# EAGLE design dw-shield-V1.1 (EAGLE 9.5.1)
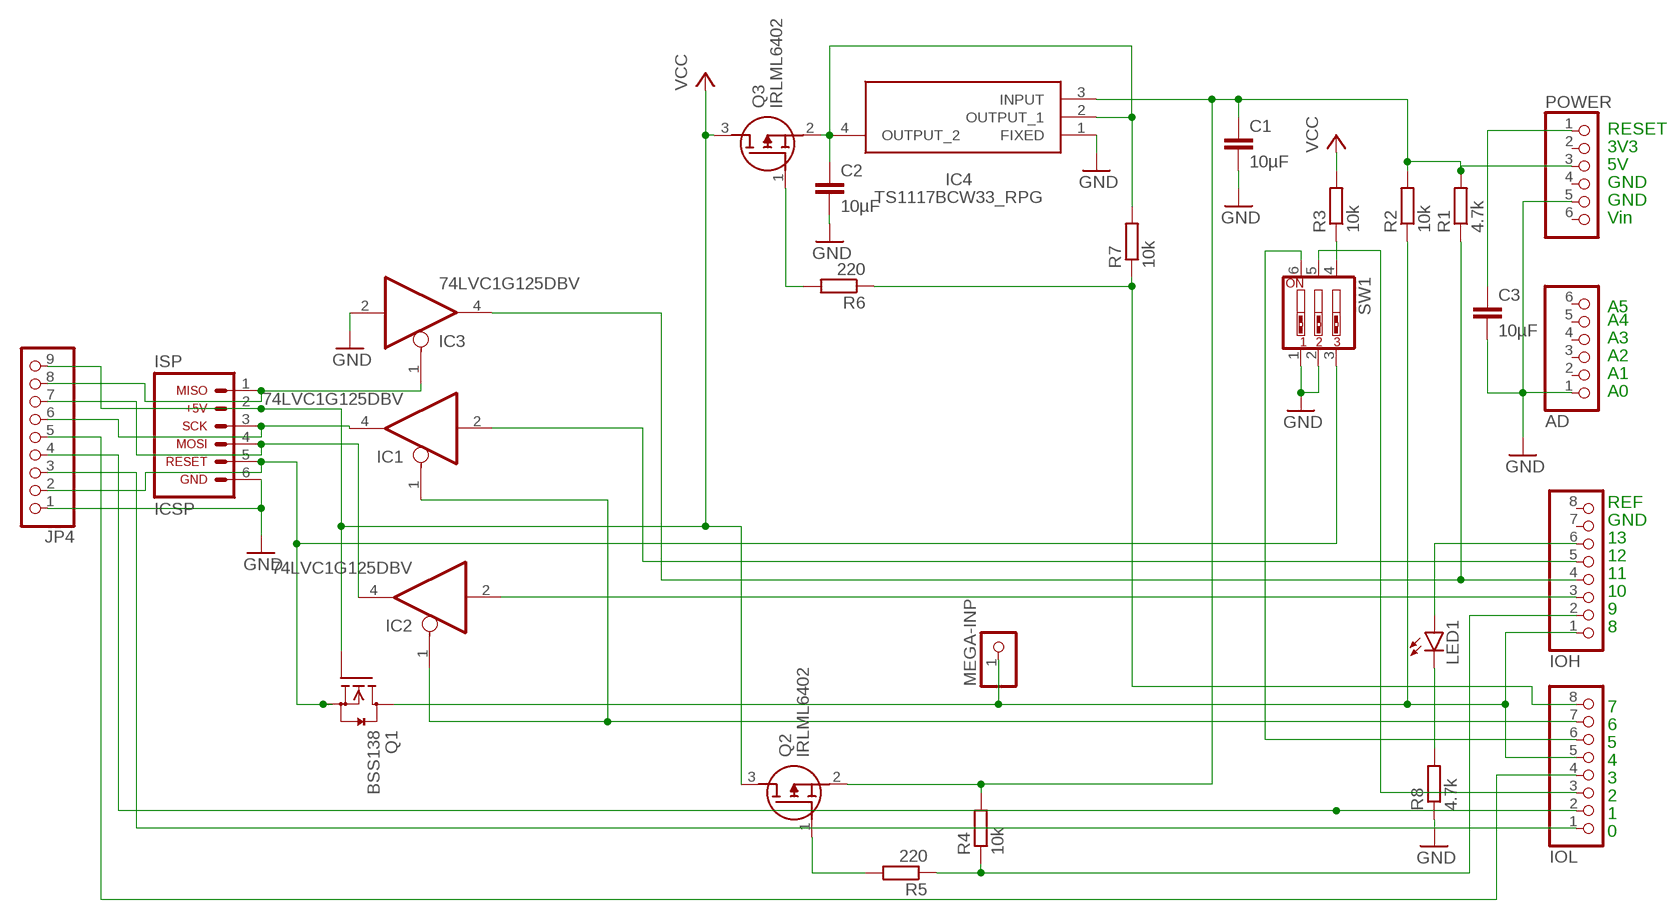
[diagram p0: schematic, sheet 1]

## Parts
AD  PINHD-1X6  [1X06]
C1  10µF  C-EUC1206  [C1206]
C2  10µF  C-EUC1206  [C1206]
C3  10µF  C-EUC1206  [C1206]
IC1  74LVC1G125DBV  [SOT23-5]
IC2  74LVC1G125DBV  [SOT23-5]
IC3  74LVC1G125DBV  [SOT23-5]
IC4  TS1117BCW33_RPG  [SOT230P700X190-4N]
IOH  PINHD-1X8  [1X08]
IOL  PINHD-1X8  [1X08]
ISP  ARDUINO_CONN-ICSP  [CONN-2X03]
JP4  PINHD-1X9  [1X09]
LED1  LEDCHIPLED_1206  [CHIPLED_1206]
MEGA-INP  PINHD-1X1  [1X01]
POWER  PINHD-1X6  [1X06]
Q1  BSS138  [SOT23]
Q2  IRLML6402  [SOT95P237X112-3N]
Q3  IRLML6402  [SOT95P237X112-3N]
R1  4.7k  R-EU_R1206  [R1206]
R2  10k  R-EU_R1206  [R1206]
R3  10k  R-EU_R1206  [R1206]
R4  10k  R-EU_R1206  [R1206]
R5  220  R-EU_R1206  [R1206]
R6  220  R-EU_R1206  [R1206]
R7  10k  R-EU_R1206  [R1206]
R8  4.7k  R-EU_R1206  [R1206]
SW1  SW_DIP-3  [EDG-03]

## Nets
GND: AD.1 C1.2 C2.2 C3.2 IC3.2(I) IC4.1(FIXED) ISP.6 JP4.1 POWER.5 R8.1 SW1.1 SW1.2
N$1: C1.1 IC4.3(INPUT) POWER.3 Q2.2(S) R1.2 R2.2 R4.2
N$2: IOH.1 IOL.5 MEGA-INP.1 Q1.3(D) R2.1
N$3: IC1.4(O) ISP.3 JP4.6
N$4: IC3.1(OE) ISP.1 JP4.8
N$5: IC2.4(O) ISP.4 JP4.7
N$6: IC1.1(OE) IC2.1(OE) IOL.7
N$7: IC2.2(I) IOH.3
N$8: IC1.2(I) IOH.5
N$9: IC3.4(O) IOH.4 R1.1
N$10: Q2.1(G) R5.2
N$11: ISP.5 JP4.2 Q1.2(S) SW1.3
N$12: R3.1 SW1.4
N$13: IOL.6 SW1.6
N$14: IOL.3 SW1.5
N$15: C2.1 IC4.2(OUTPUT_1) IC4.4(OUTPUT_2) Q3.2(S) R7.2
N$16: IOH.2 R4.1 R5.1
N$17: Q3.1(G) R6.2
N$18: IOL.8 R6.1 R7.1
N$19: C3.1 POWER.1
N$20: IOL.2 JP4.4
N$21: IOH.6 LED1.A
N$22: LED1.C R8.2
N$23: IOL.1 JP4.3
N$24: IOL.4 JP4.5
VCC: ISP.2 JP4.9 Q1.1(G) Q2.3(D) Q3.3(D) R3.2
Unconnected: AD.2 AD.3 AD.4 AD.5 AD.6 IOH.7 IOH.8 POWER.2 POWER.4 POWER.6

## Notes on the sheet
- RESET
- 3V3
- 5V
- GND
- GND
- Vin
- A5
- A4
- A3
- A2
- A1
- A0
- REF
- GND
- 13
- 12
- 11
- 10
- 9
- 8
- 7
- 6
- 5
- 4
- 3
- 2
- 1
- 0

## Power pins joined to a net without a drawn wire
GND: IC1.3(GND) IC2.3(GND) IC3.3(GND)
VCC: IC1.5(VCC) IC2.5(VCC) IC3.5(VCC)

## Library data of the parts
AD POWER = pinhead:PINHD-1X6: PIN HEADER
C1-C3 = rcl:C-EU: CAPACITOR, European symbol; SPICEPREFIX: C
IC1-IC3 = 74xx-little-us:74*1G125: Single Bus Buffer Gate with 3-State Output
IC4 = TS1117BCW33_RPG:TS1117BCW33_RPG: Taiwan Semiconductor TS1117BCW33 RPG, LDO Regulator, 800mA, 3.3 V, +/-2% 4-Pin, SOT-223 Source: Datasheet <http://uk.rs-online.com/web/p/products/1698939>; ARROW_PART_NUMBER: TS1117BCW33 RPG; ARROW_PRICE-STOCK: https://www.arrow.com/en/products/ts1117bcw33rpg/taiwan-semiconductor; DESCRIPTION: Taiwan Semiconductor TS1117BCW33 RPG, LDO Regulator, 800mA, 3.3 V, +/-2% 4-Pin, SOT-223; HEIGHT: 1.9mm; MANUFACTURER_NAME: Taiwan Semiconductor; MANUFACTURER_PART_NUMBER: TS1117BCW33 RPG; MOUSER_PART_NUMBER: 821-TS1117BCW33RPG; MOUSER_PRICE-STOCK: https://www.mouser.co.uk/ProductDetail/Taiwan-Semiconductor/TS1117BCW33-RPG?qs=5aG0NVq1C4zdwcJSPRwZGg%3D%3D
IOH IOL = pinhead:PINHD-1X8: PIN HEADER
ISP = arduino_jw:ARDUINO_CONN-ICSP: Arduino ICSP I/O Header This is the ICSP I/O header on the Arduino Uno R3. This connector is labeled with the following pin assignments: MISO +5V SCK MOSI RESET GND NOTE: Be sure you install this connector with the correct orientation on your PCB layout. Pin 1 has a square pad to assist with orientation.
JP4 = pinhead:PINHD-1X9: PIN HEADER
LED1 = led:LED: LED OSRAM: - CHIPLED LG R971, LG N971, LY N971, LG Q971, LY Q971, LO R971, LY R971 LH N974, LH R974 LS Q976, LO Q976, LY Q976 LO Q996 - Hyper CHIPLED LW Q18S LB Q993, LB Q99A, LB R99A - SideLED LS A670, LO A670, LY A670, LG A670, LP A670 LB A673, LV A673, LT A673, LW A673 LH A674 LY A675 LS A676, LA A676, LO A676, LY A676, LW A676 LS A679, LY A679, LG A679 - Hyper Micro SIDELED® LS Y876, LA Y876, LO Y876, LY Y876 LT Y87S - SmartLED LW L88C, LW L88S LB L89C, LB L89S, LG L890 LS L89K, LO L89K, LY L89K LS L896, LA L896, LO L896, LY L896 - TOPLED LS T670, LO T670, LY T670, LG T670, LP T670 LSG T670, LSP T670, LSY T670, LOP T670, LYG T670 LG T671, LOG T671, LSG T671 LB T673, LV T673, LT T673, LW T673 LH T674 LS T676, LA T676, LO T676, LY T676, LB T676, LH T676, LSB T676, LW T676 LB T67C, LV T67C, LT T67C, LS T67K, LO T67K, LY T67K, LW E67C LS E67B, LA E67B, LO E67B, LY E67B, LB E67C, LV E67C, LT E67C LW T67C LS T679, LY T679, LG T679 LS T770, LO T770, LY T770, LG T770, LP T770 LB T773, LV T773, LT T773, LW T773 LH T774 LS E675, LA E675, LY E675, LS T675 LS T776, LA T776, LO T776, LY T776, LB T776 LHGB T686 LT T68C, LB T68C - Hyper Mini TOPLED® LB M676 - Mini TOPLED Santana® LG M470 LS M47K, LO M47K, LY M47K Source: http://www.osram.convergy.de LUXEON: - LUMILED® LXK2-PW12-R00, LXK2-PW12-S00, LXK2-PW14-U00, LXK2-PW14-V00 LXK2-PM12-R00, LXK2-PM12-S00, LXK2-PM14-U00 LXK2-PE12-Q00, LXK2-PE12-R00, LXK2-PE12-S00, LXK2-PE14-T00, LXK2-PE14-U00 LXK2-PB12-K00, LXK2-PB12-L00, LXK2-PB12-M00, LXK2-PB14-N00, LXK2-PB14-P00, LXK2-PB14-Q00 LXK2-PR12-L00, LXK2-PR12-M00, LXK2-PR14-Q00, LXK2-PR14-R00 LXK2-PD12-Q00, LXK2-PD12-R00, LXK2-PD12-S00 LXK2-PH12-R00, LXK2-PH12-S00 LXK2-PL12-P00, LXK2-PL12-Q00, LXK2-PL12-R00 Source: www.luxeon.com KINGBRIGHT: KA-3528ASYC Source: www.kingbright.com
MEGA-INP = pinhead:PINHD-1X1: PIN HEADER
Q1 = m-pad-2.1:BSS138: Fairchild Semiconductors BSS138 N-Channel Logic Level Enhancement Mode Field Effect Transistor General Description: These N-Channel enhancement mode field effect transistors are produced using Fairchild's proprietary, high cell density, DMOS technology. These products have been designed to minimize on-state resistance while provide rugged, reliable, and fast switching performance.These products are particularly suited for low voltage, low current applications such as small servo motor control, power MOSFET gate drivers, and other switching applications. Features: 0.22 A, 50 V. RDS(ON) = 3.5Ohm @ VGS = 10 V RDS(ON) = 6.0Ohm @ VGS = 4.5 V High density cell design for extremely low RDS(ON) Rugged and Reliable Compact industry standard SOT-23 surface mount package Please send any comments to: messi@users.sourceforge.net
Q2 Q3 = IRLML6402:IRLML6402: P-Channel MOSFET Transistor, 3.7 A, 20 V, 3-Pin SOT-23 International Rectifier IRLML6402 Source: Datasheet <https://datasheetspdf.com/pdf/513015/InternationalRectifier/IRLML6402/1>; DESCRIPTION: P-Channel MOSFET Transistor, 3.7 A, 20 V, 3-Pin SOT-23 International Rectifier IRLML6402; HEIGHT: 1.12mm; MANUFACTURER_NAME: Infineon; MANUFACTURER_PART_NUMBER: IRLML6402; MOUSER_PART_NUMBER: N/A; MOUSER_PRICE-STOCK: https://www.mouser.co.uk/ProductDetail/Infineon-IR/IRLML6402/?qs=Gkr2N%2F2q3o277qI%252BRzUP%252Bw%3D%3D
R1-R8 = rcl:R-EU_: RESISTOR, European symbol; SPICEPREFIX: R
SW1 = special:SW_DIP-3: DIP SWITCH

## Net classes
0 default: width 0.152 mm, drill 0.305 mm, clearance 0.152 mm

## Board
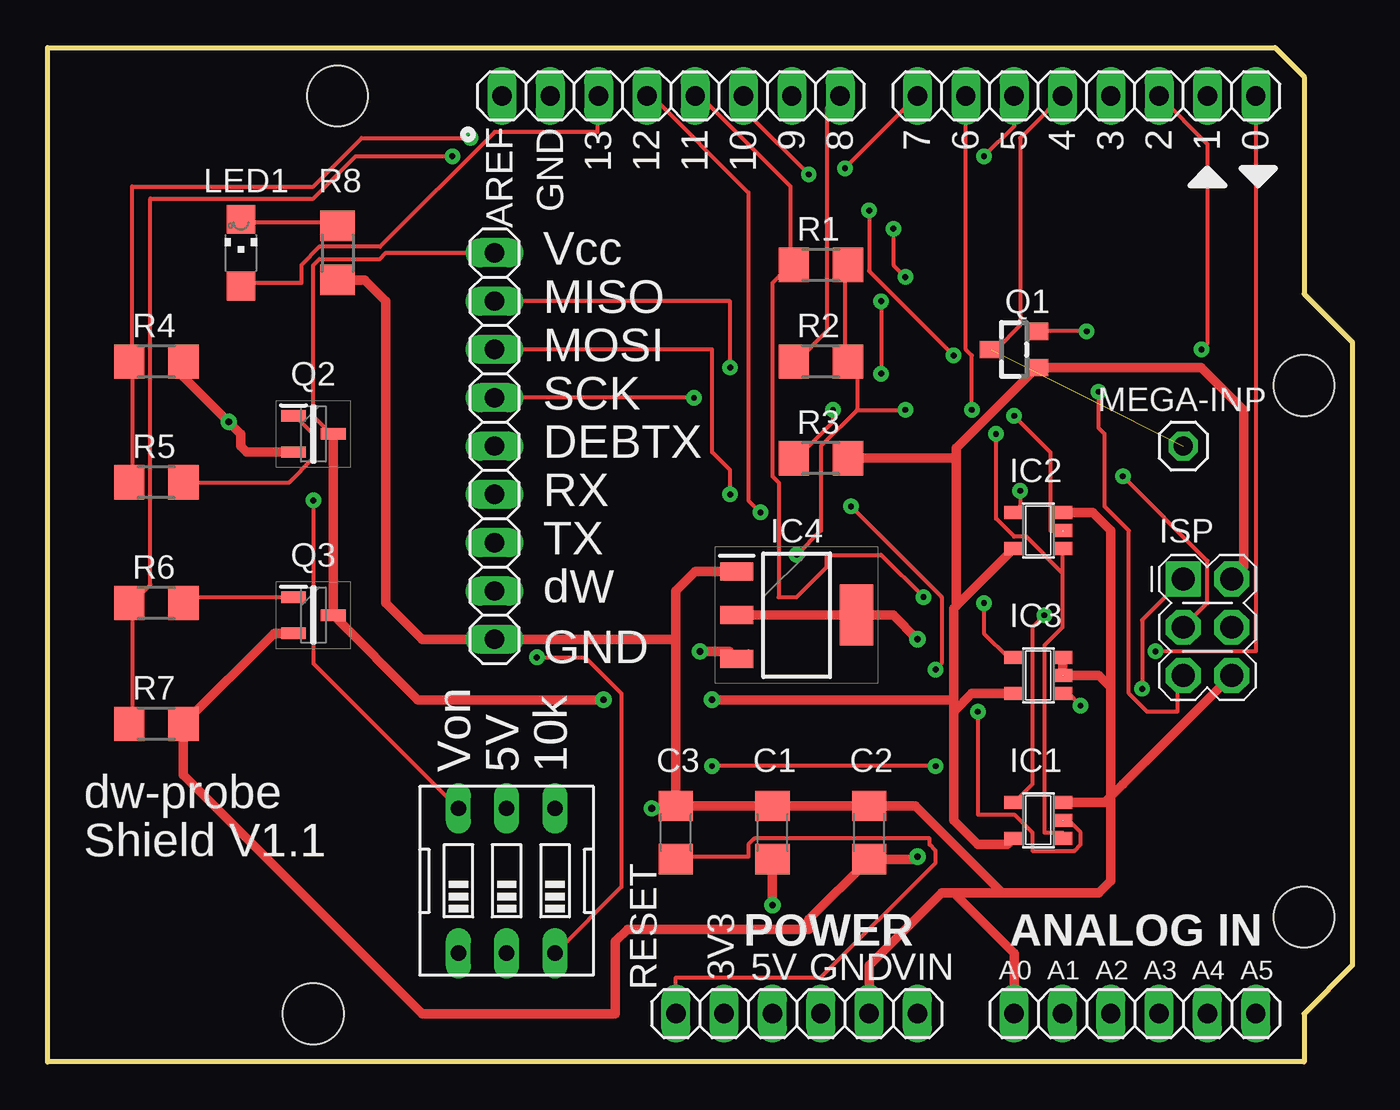
[diagram p1: board, top side]
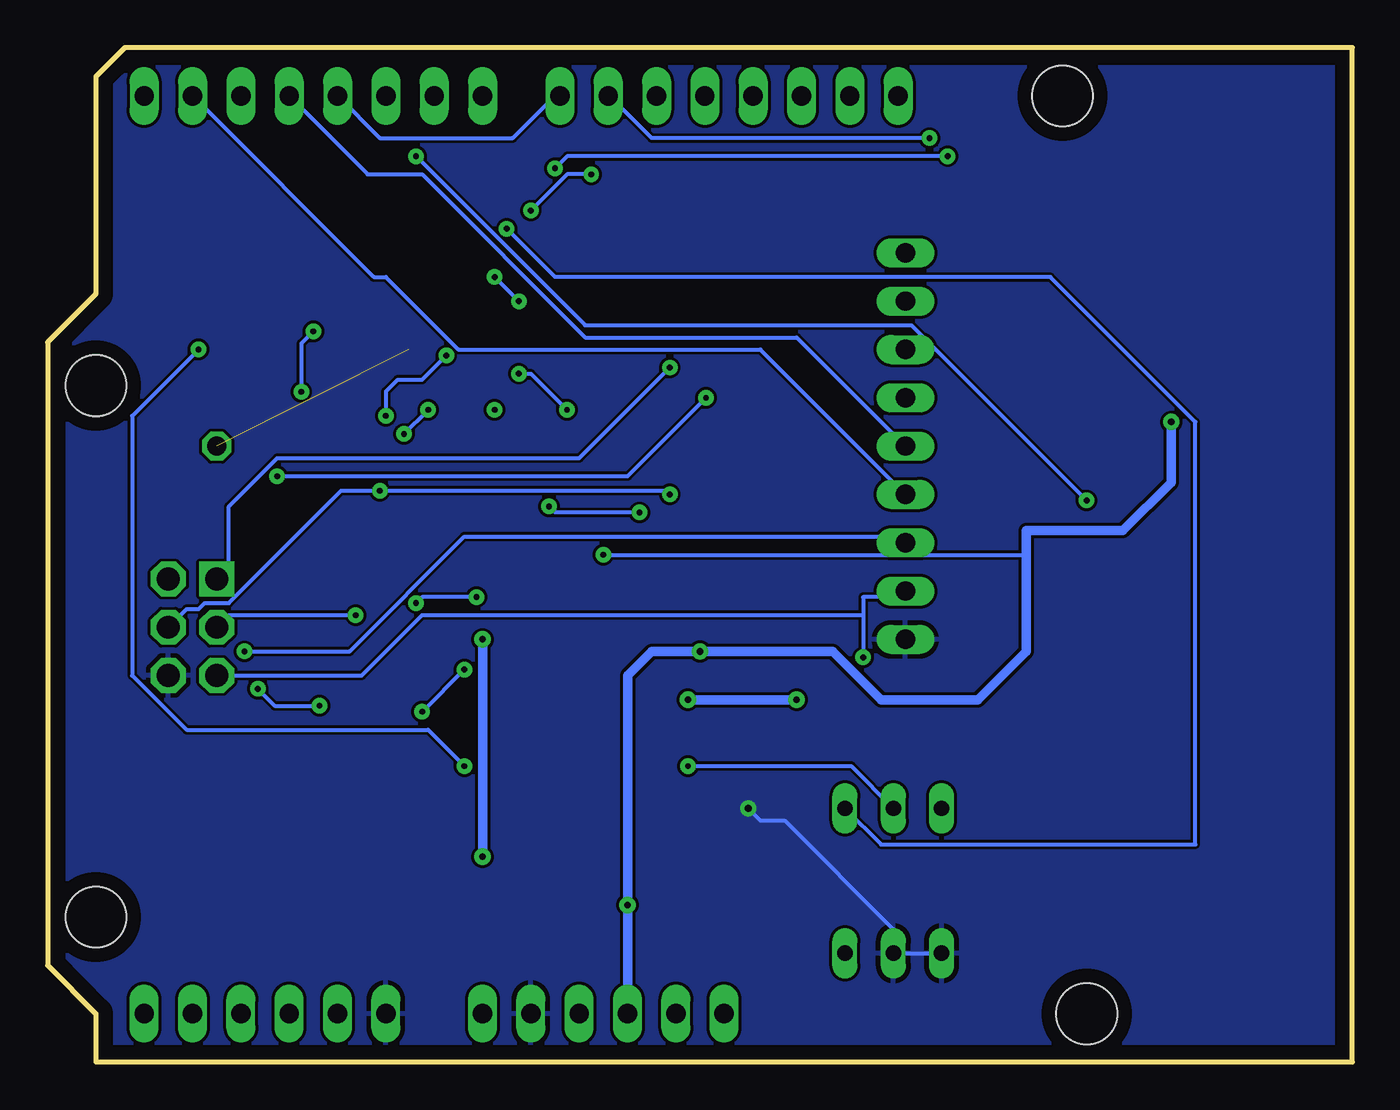
[diagram p2: board, bottom side, seen from below]

Size 68.58 x 53.34 mm. Coordinates in mm from the lower left corner, seen from the top.
Outline: 0,53.34 64.52,53.34 66.04,51.82 66.04,40.39 68.58,37.85 68.58,5.08 66.04,2.54 66.04,0 0,0 0,53.34
Copper layers (1*16): Top 0.035mm / dielectric 1.5mm / Bottom 0.035mm
Design rules "default *": minimum track width 8mil, minimum drill 12mil, track to track 6mil, track to pad 6mil, pad to pad 6mil, via to via 6mil, smd to smd 6mil, copper to edge 30mil, drill to drill 12mil, minimum pad ring 10mil, minimum via ring 10mil, stop-mask expansion 1mil, vias tented up to drill 0mil, thermal gap 10mil
Holes 3.2 mm at 66.04,35.56 66.04,7.62 15.24,50.8 13.97,2.54

### Footprints (pad centres in the part's own frame; a part is rotated, then mirrored left to right if it is on the bottom)
1X06 = drill 1.016 long: 1 -6.35,0; 2 -3.81,0; 3 -1.27,0; 4 1.27,0; 5 3.81,0; 6 6.35,0
C1206 = smd 1.6 x 1.8: 1 -1.4,0; 2 1.4,0
SOT23-5 = smd 0.69 x 0.99: 1 -0.95,-1.29; 2 0,-1.29; 3 0.95,-1.29; 4 0.95,1.3; 5 -0.95,1.3
SOT230P700X190-4N = smd 1.75 x 0.95: 1 -3.15,2.3; 2 -3.15,0; 3 -3.15,-2.3 | smd 1.75 x 3.2: 4 3.15,0
1X08 = drill 1.016 long: 1 -8.89,0; 2 -6.35,0; 3 -3.81,0; 4 -1.27,0; 5 1.27,0; 6 3.81,0; 7 6.35,0; 8 8.89,0
CONN-2X03 = drill 1.2 pad 1.829 square: 1 0,0 | drill 1.2 pad 1.829 octagon: 2 2.54,0; 3 0,-2.54; 4 2.54,-2.54; 5 0,-5.08; 6 2.54,-5.08
1X09 = drill 1.016 long: 1 -10.16,0; 2 -7.62,0; 3 -5.08,0; 4 -2.54,0; 5 0,0; 6 2.54,0; 7 5.08,0; 8 7.62,0; 9 10.16,0
CHIPLED_1206 = smd 1.5 x 1.5: A 0,-1.75; C 0,1.75
1X01 = drill 1.016 octagon: 1 0,0
SOT23 = smd 0.9 x 1.2: 1 -0.95,-1.2; 2 0.95,-1.2; 3 0,1.2
SOT95P237X112-3N = smd 1.3 x 0.6: 1 -1.05,0.95; 2 -1.05,-0.95; 3 1.05,0
R1206 = smd 1.6 x 1.803: 1 -1.422,0; 2 1.422,0
EDG-03 = drill 0.813 long: 1 -2.54,-3.81; 2 0,-3.81; 3 2.54,-3.81; 4 2.54,3.81; 5 0,3.81; 6 -2.54,3.81

### Placement (x,y rotation side)
AD  57.15,2.54 0 top
C1  38.1,12.06 90 top
C2  43.18,12.06 90 top
C3  33.02,12.06 90 top
IC1  52.07,12.7 90 top
IC2  52.07,27.94 90 top
IC3  52.07,20.32 90 top
IC4  39.37,23.5 0 top
IOH  32.77,50.8 180 top
IOL  54.61,50.8 180 top
ISP  59.69,25.4 0 top
JP4  23.5,32.38 90 top
LED1  10.16,42.55 0 top
MEGA-INP  59.69,32.38 0 top
POWER  39.37,2.54 0 top
Q1  50.8,37.47 90 top
Q2  13.97,33.02 0 top
Q3  13.97,23.5 0 top
R1  40.64,41.91 0 top
R2  40.64,36.83 0 top
R3  40.64,31.75 0 top
R4  5.71,36.83 0 top
R5  5.71,30.48 0 top
R6  5.71,24.13 0 top
R7  5.71,17.78 0 top
R8  15.24,42.55 90 top
SW1  24.13,9.53 0 top

### Tracks (layer width: path | path; a pad name or v marks a point on that pad's centre or on a via)
GND  (via drill 0.35)
  Top 0.203: C3.2 32.89,13.34 v31.75,13.34
  Top 0.508: ISP.6 56.52,14.61 55.88,13.97 | 55.88,19.68 55.24,20.32 IC3.2 IC3.3 | 55.88,19.68 55.88,14.61 | 55.88,14.61 55.88,13.97 | 55.88,19.68 55.88,20.32 55.88,27.94 54.93,28.89 IC2.3 | 33.02,22.23 C3.2 C1.2 C2.2 45.59,13.46 50.16,8.89 | 33.02,22.23 33.02,24.77 34.05,25.8 IC4.1 | 33.02,22.23 30.48,22.23 JP4.1 19.68,22.23 17.78,24.13 17.78,40.01 16.66,41.12 R8.1 | 55.88,13.97 55.56,13.65 IC1.3 | 50.16,8.89 55.24,8.89 55.88,9.53 55.88,14.61 | POWER.5 43.18,5.08 46.99,8.89 47.62,8.89 | 47.62,8.89 50.16,8.89 | AD.1 50.8,5.71 47.62,8.89
  Bottom 0.203: v31.75,13.34 31.11,12.7 29.84,12.7 24.13,6.99 SW1.2 SW1.1
  pour Bottom (rank 2): 0.64,52.7 67.69,52.7 67.94,52.45 67.94,0.64 0.89,0.64 0.64,0.89 0.64,30.48 0.64,46.35
N$1  (via drill 0.3, 0.35)
  Top 0.203: 41.91,36.83 41.91,41.91 R1.2 | 41.91,36.83 R2.2 | 41.91,36.83 R2.2 | 36.83,21.59 IC4.3 | 42.55,34.29 v45.09,34.29 | 42.55,34.29 42.55,36.83 R2.2 | v39.37,26.67 40.64,27.94 40.64,32.38 42.55,34.29
  Top 0.508: v38.1,8.26 C1.1 | v34.29,21.59 34.92,21.59 35.83,21.59 IC4.3 | Q2.2 10.47,32.07 10.16,32.38 10.16,33.02 v9.53,33.66 7.14,36.04 R4.2
  Bottom 0.203: v39.37,26.67 17.14,26.67
  Bottom 0.508: POWER.3 v38.1,8.26 38.1,20.32 36.83,21.59 v34.29,21.59 27.3,21.59 24.77,19.05 19.68,19.05 17.14,21.59 17.14,26.04 17.14,26.67 17.14,27.94 12.06,27.94 9.53,30.48 v9.53,33.66
N$2  (1 unrouted)
  Top 0.203: R2.1 39.37,36.83 40.96,38.42 40.96,50.16 41.59,50.8 IOH.1 | IOL.5 51.75,49.21 51.12,48.58 51.12,38.73 49.85,37.47 Q1.3
  Bottom 0.203: IOL.5 51.12,48.58 44.13,48.58 41.91,50.8 IOH.1
N$3  (via drill 0.3)
  Top 0.203: v52.39,23.5 51.75,22.86 51.75,14.61 50.8,13.65 IC1.4 | v33.97,34.92 JP4.6 | v56.52,30.8 60.96,26.35 60.96,24.13 ISP.3
  Bottom 0.203: ISP.3 59.05,23.5 v52.39,23.5 | v33.97,34.92 38.1,30.8 v56.52,30.8
N$4  (via drill 0.3)
  Top 0.203: v54.29,18.73 53.66,19.37 IC3.1 | v57.53,19.62 57.53,23.24 ISP.1 | JP4.8 35.88,40.01 v35.88,36.51
  Bottom 0.203: v57.53,19.62 56.64,18.73 v54.29,18.73 | v35.88,36.51 40.64,31.75 56.52,31.75 59.05,29.21 59.05,25.4 ISP.1
N$5  (via drill 0.3)
  Top 0.203: IC2.4 51.12,29.24 v51.12,30.04 | JP4.7 34.92,37.47 34.92,32.07 35.88,31.11 v35.88,29.84
  Bottom 0.203: ISP.4 61.28,23.81 60.64,23.81 60.33,24.13 59.05,24.13 53.15,30.04 v51.12,30.04 36.07,30.04 v35.88,29.84
N$6  (via drill 0.3)
  Top 0.203: 53.34,25.72 53.34,26.99 IC2.1 | 53.34,25.72 53.34,22.86 52.39,21.91 52.39,12.06 53.34,12.06 IC1.1 | IOL.7 48.26,37.47 48.58,37.15 v48.58,34.29 | v49.85,33.02 49.85,28.57 50.8,27.62 51.44,27.62 53.34,25.72
  Bottom 0.203: v49.85,33.02 v48.58,34.29
N$7  (via drill 0.3)
  Top 0.203: v50.8,33.97 52.7,32.07 52.7,30.8 52.7,27.94 53.34,27.94 IC2.2 | v47.62,37.15 43.18,41.59 v43.18,44.77 | v40.01,46.67 36.83,49.85 36.83,50.8 IOH.3
  Bottom 0.203: v50.8,33.97 50.8,35.24 50.16,35.88 48.9,35.88 v47.62,37.15 | v43.18,44.77 41.27,46.67 v40.01,46.67
N$8  (via drill 0.3)
  Top 0.203: v48.9,18.41 48.9,13.02 50.8,13.02 51.75,12.06 51.75,11.11 53.98,11.11 54.29,11.43 54.29,12.06 53.66,12.7 IC1.2 | v46.67,20.64 46.99,20.95 46.99,24.45 v42.23,29.21 | v37.47,28.89 36.83,29.53 36.83,45.72 31.75,50.8 IOH.5
  Bottom 0.203: v46.67,20.64 v48.9,18.41 | v42.23,29.21 41.91,28.89 v37.47,28.89
N$9  (via drill 0.3)
  Top 0.203: v49.21,24.13 49.21,22.54 50.48,21.27 IC3.4 | v46.04,24.45 43.81,26.67 40.96,26.67 40.96,26.04 39.37,24.45 38.42,24.45 38.42,30.48 38.1,30.8 38.1,40.96 39.05,41.91 | 39.05,41.91 R1.1 39.05,41.91 | 39.05,41.91 39.05,46.04 34.29,50.8 IOH.4
  Bottom 0.203: v49.21,24.13 48.9,24.45 v46.04,24.45
N$10
  Top 0.203: Q2.1 13.02,33.97 13.97,33.02 13.97,31.75 12.7,30.48 7.3,30.48 R5.2
N$11  (via drill 0.3)
  Top 0.203: SW1.3 30.16,9.21 30.16,19.37 28.26,21.27 v25.72,21.27 | Q1.2 v54.61,38.42 | v55.24,35.24 55.24,33.34 55.56,33.02 55.56,29.21 56.83,27.94 56.83,19.37 57.78,18.41 59.37,18.41 59.37,20 ISP.5
  Bottom 0.203: 25.72,23.5 25.72,24.45 23.81,24.45 JP4.2 | 25.72,23.5 v25.72,21.27 | v54.61,38.42 55.24,37.78 v55.24,35.24 | 25.72,23.5 48.9,23.5 52.07,20.32 ISP.5
N$12  (via drill 0.3)
  Top 0.203: 39.37,31.75 R3.1 39.37,31.75 | 39.37,31.75 41.27,33.66 v41.27,34.29 | v43.81,40.01 v43.81,36.2 | v45.09,41.27 44.45,41.91 v44.45,43.81
  Bottom 0.203: v41.27,34.29 43.18,36.2 v43.81,36.2 | v45.09,41.27 v43.81,40.01 | v44.45,43.81 41.91,41.27 15.88,41.27 8.26,33.66 8.26,11.43 24.77,11.43 SW1.4
N$13  (via drill 0.3)
  Top 0.203: SW1.6 13.97,20.95 v13.97,29.53 | v49.21,47.62 50.8,49.21 IOL.6
  Bottom 0.203: v13.97,29.53 23.18,38.73 40.32,38.73 v49.21,47.62
N$14  (via drill 0.3)
  Top 0.203: v46.67,15.56 v34.92,15.56 | v60.64,37.47 60.96,37.78 60.96,48.26 IOL.3
  Bottom 0.203: SW1.5 26.35,15.56 v34.92,15.56 | v46.67,15.56 48.58,17.46 61.28,17.46 64.14,20.32 64.14,33.97 v60.64,37.47
N$15  (via drill 0.35)
  Top 0.508: IC4.2 IC4.4 44.45,23.5 v45.72,22.23 | Q3.2 11.9,22.55 R7.2 7.14,15.09 19.68,2.54 29.84,2.54 29.84,6.35 30.48,6.99 40.01,6.99 40.01,7.49 C2.1 45.59,10.66 v45.72,10.79
  Bottom 0.508: v45.72,22.23 v45.72,10.79
N$16  (via drill 0.3)
  Top 0.203: 4.45,36.83 4.45,30.48 R5.1 | 4.45,36.83 R4.1 4.45,36.83 | v22.23,48.58 16.51,48.58 13.97,46.04 4.45,46.04 4.45,36.83
  Bottom 0.203: v22.23,48.58 36.83,48.58 39.05,50.8 IOH.2
N$17
  Top 0.203: Q3.1 12.7,24.45 7.3,24.45 7.3,24.13 R6.2
N$18  (via drill 0.3)
  Top 0.203: 4.45,24.13 4.45,17.78 R7.1 | 4.45,24.13 R6.1 4.45,24.13 | v41.91,46.99 IOL.8 | v21.27,47.62 16.19,47.62 13.97,45.4 5.4,45.4 5.4,25.08 4.45,24.13
  Bottom 0.203: v41.91,46.99 41.27,47.62 v21.27,47.62
N$19
  Top 0.203: POWER.1 33.02,4.45 40.64,4.45 46.67,10.48 46.67,11.11 46.35,11.43 46.35,11.75 37.15,11.75 36.83,11.43 36.83,10.79 33.02,10.79 C3.1
N$20
  Bottom 0.203: JP4.4 31.11,37.47 46.99,37.47 50.8,41.27 51.44,41.27 IOL.2
N$21
  Top 0.203: LED1.A 10.16,40.96 13.34,40.96 13.34,41.91 14.29,42.86 17.46,42.86 23.5,48.9 28.89,48.9 28.89,50.8 IOH.6
N$22
  Top 0.203: LED1.C 10.16,44.13 15.24,44.13 R8.2
N$23  (via drill 0.3)
  Top 0.203: v58.23,21.59 63.5,21.59 IOL.1
  Bottom 0.203: JP4.3 23.81,27.62 46.67,27.62 52.7,21.59 v58.23,21.59
N$24
  Bottom 0.203: JP4.5 29.21,38.1 40.32,38.1 48.9,46.67 51.75,46.67 IOL.4
VCC  (via drill 0.35)
  Top 0.203: JP4.9 17.78,42.55 17.46,42.23 14.29,42.23 13.97,41.91 13.97,33.97 14.92,33.02 Q2.3
  Top 0.508: IC1.5 50.45,11.43 48.9,11.43 47.62,12.7 47.62,18.41 | 47.62,18.41 48.58,19.37 IC3.5 | 47.62,18.41 47.62,19.05 | 47.62,19.05 47.62,23.84 47.77,23.99 | 47.77,23.99 IC2.5 | 47.77,23.99 47.77,31.75 | 47.77,31.75 47.77,32.28 Q1.1 60.64,36.52 62.87,34.29 62.87,26.04 ISP.2 | R3.2 47.77,31.75 | Q2.3 Q3.3 19.46,19.05 v29.21,19.05 | v34.92,19.05 47.62,19.05
  Bottom 0.508: v29.21,19.05 v34.92,19.05

### Text on the board
tPlace: 13 | 12 | 11 | 10 | 9 | 8 | 7 | 6 | 5 | 4 | 3 | 2 | 1 | 0
tNames: AREF | GND | Vcc | MISO | MOSI | SCK | DEBTX | RX | TX | dW | GND | Von | 5V | 10k | dw-probe | Shield V1.1 | ANALOG IN | RESET | 3V3 | 5V | GND | VIN | A0 | A1 | A2 | A3 | A4 | A5
214bmp: D:/SmartProjects/Snc/a4_bn_logo2.bmp